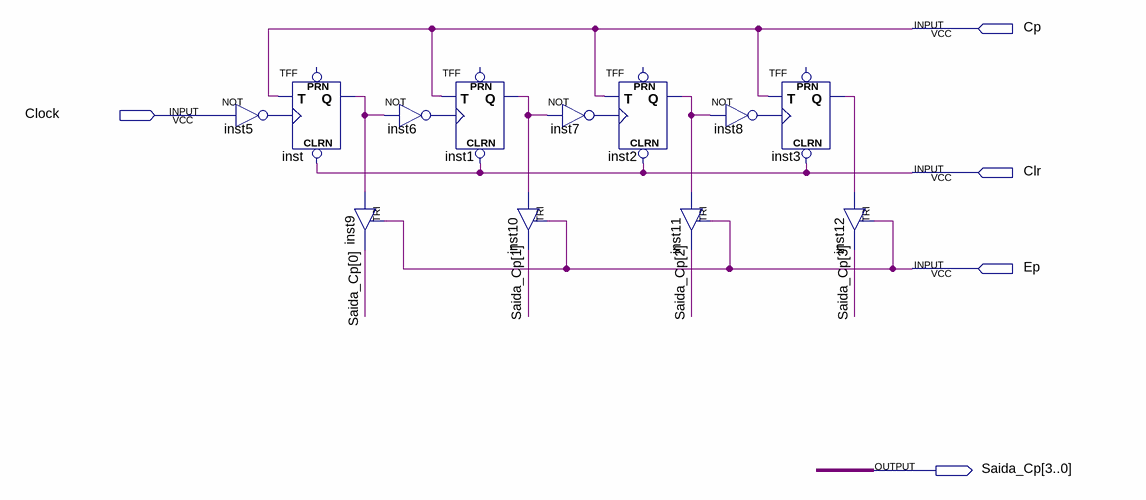
[diagram p0: schematic sheet]
// Quartus schematic Contador_programa.bdf as structural Verilog: 12 symbols, 5 pins
module Contador_programa (
  input  Cp,
  input  Clock,
  input  Clr,
  input  Ep,
  output [3:0] Saida_Cp
);

  wire inst1_q, inst2_q, inst3_q, inst5_out, inst6_out, inst7_out, inst8_out, inst_q;

  not inst5 (inst5_out, Clock);
  TFF inst (.CLRN(Clr), .T(Cp), .CLK(inst5_out), .Q(inst_q));  // open: PRN
  TRI inst9 (.IN(inst_q), .OE(Ep), .OUT(Saida_Cp[0]));
  not inst6 (inst6_out, inst_q);
  TFF inst1 (.CLRN(Clr), .T(Cp), .CLK(inst6_out), .Q(inst1_q));  // open: PRN
  not inst7 (inst7_out, inst1_q);
  TRI inst10 (.IN(inst1_q), .OE(Ep), .OUT(Saida_Cp[1]));
  TFF inst2 (.CLRN(Clr), .T(Cp), .CLK(inst7_out), .Q(inst2_q));  // open: PRN
  not inst8 (inst8_out, inst2_q);
  TRI inst11 (.IN(inst2_q), .OE(Ep), .OUT(Saida_Cp[2]));
  TFF inst3 (.CLRN(Clr), .T(Cp), .CLK(inst8_out), .Q(inst3_q));  // open: PRN
  TRI inst12 (.IN(inst3_q), .OE(Ep), .OUT(Saida_Cp[3]));
endmodule
